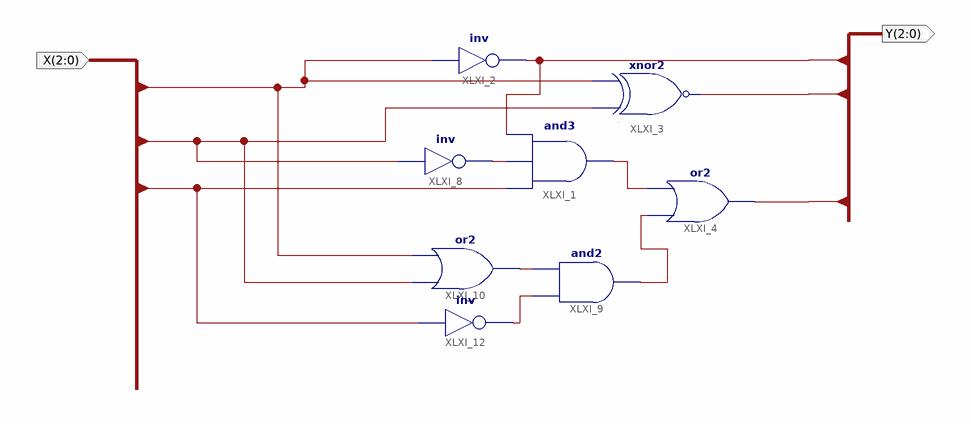
[diagram p0: schematic sheet 1]
// Xilinx ISE schematic source1.sch (xc9500xl) as structural Verilog: 8 symbols, 2 ports
module source1 (
  input  [2:0] X,
  output [2:0] Y
);

  wire XLXN_18, XLXN_20, XLXN_24, XLXN_25, XLXN_32;

  not XLXI_2 (Y[0], X[0]);
  xnor XLXI_3 (Y[1], X[1], X[0]);
  or XLXI_4 (Y[2], XLXN_24, XLXN_18);
  and XLXI_1 (XLXN_18, X[2], XLXN_20, Y[0]);
  not XLXI_8 (XLXN_20, X[1]);
  and XLXI_9 (XLXN_24, XLXN_32, XLXN_25);
  or XLXI_10 (XLXN_25, X[1], X[0]);
  not XLXI_12 (XLXN_32, X[2]);
endmodule
